# EasyEDA Pro project ProPrj_CyberRP_2025-01-25.epro

# Schematic Schematic1
Create Date: 2025-01-18; Page Name: P1; Project Name: CyberRP; Schematic Name: Schematic1; Update Date: 2025-01-19; Company: 嘉立创EDA; Page Size: A4; Version: V1.0
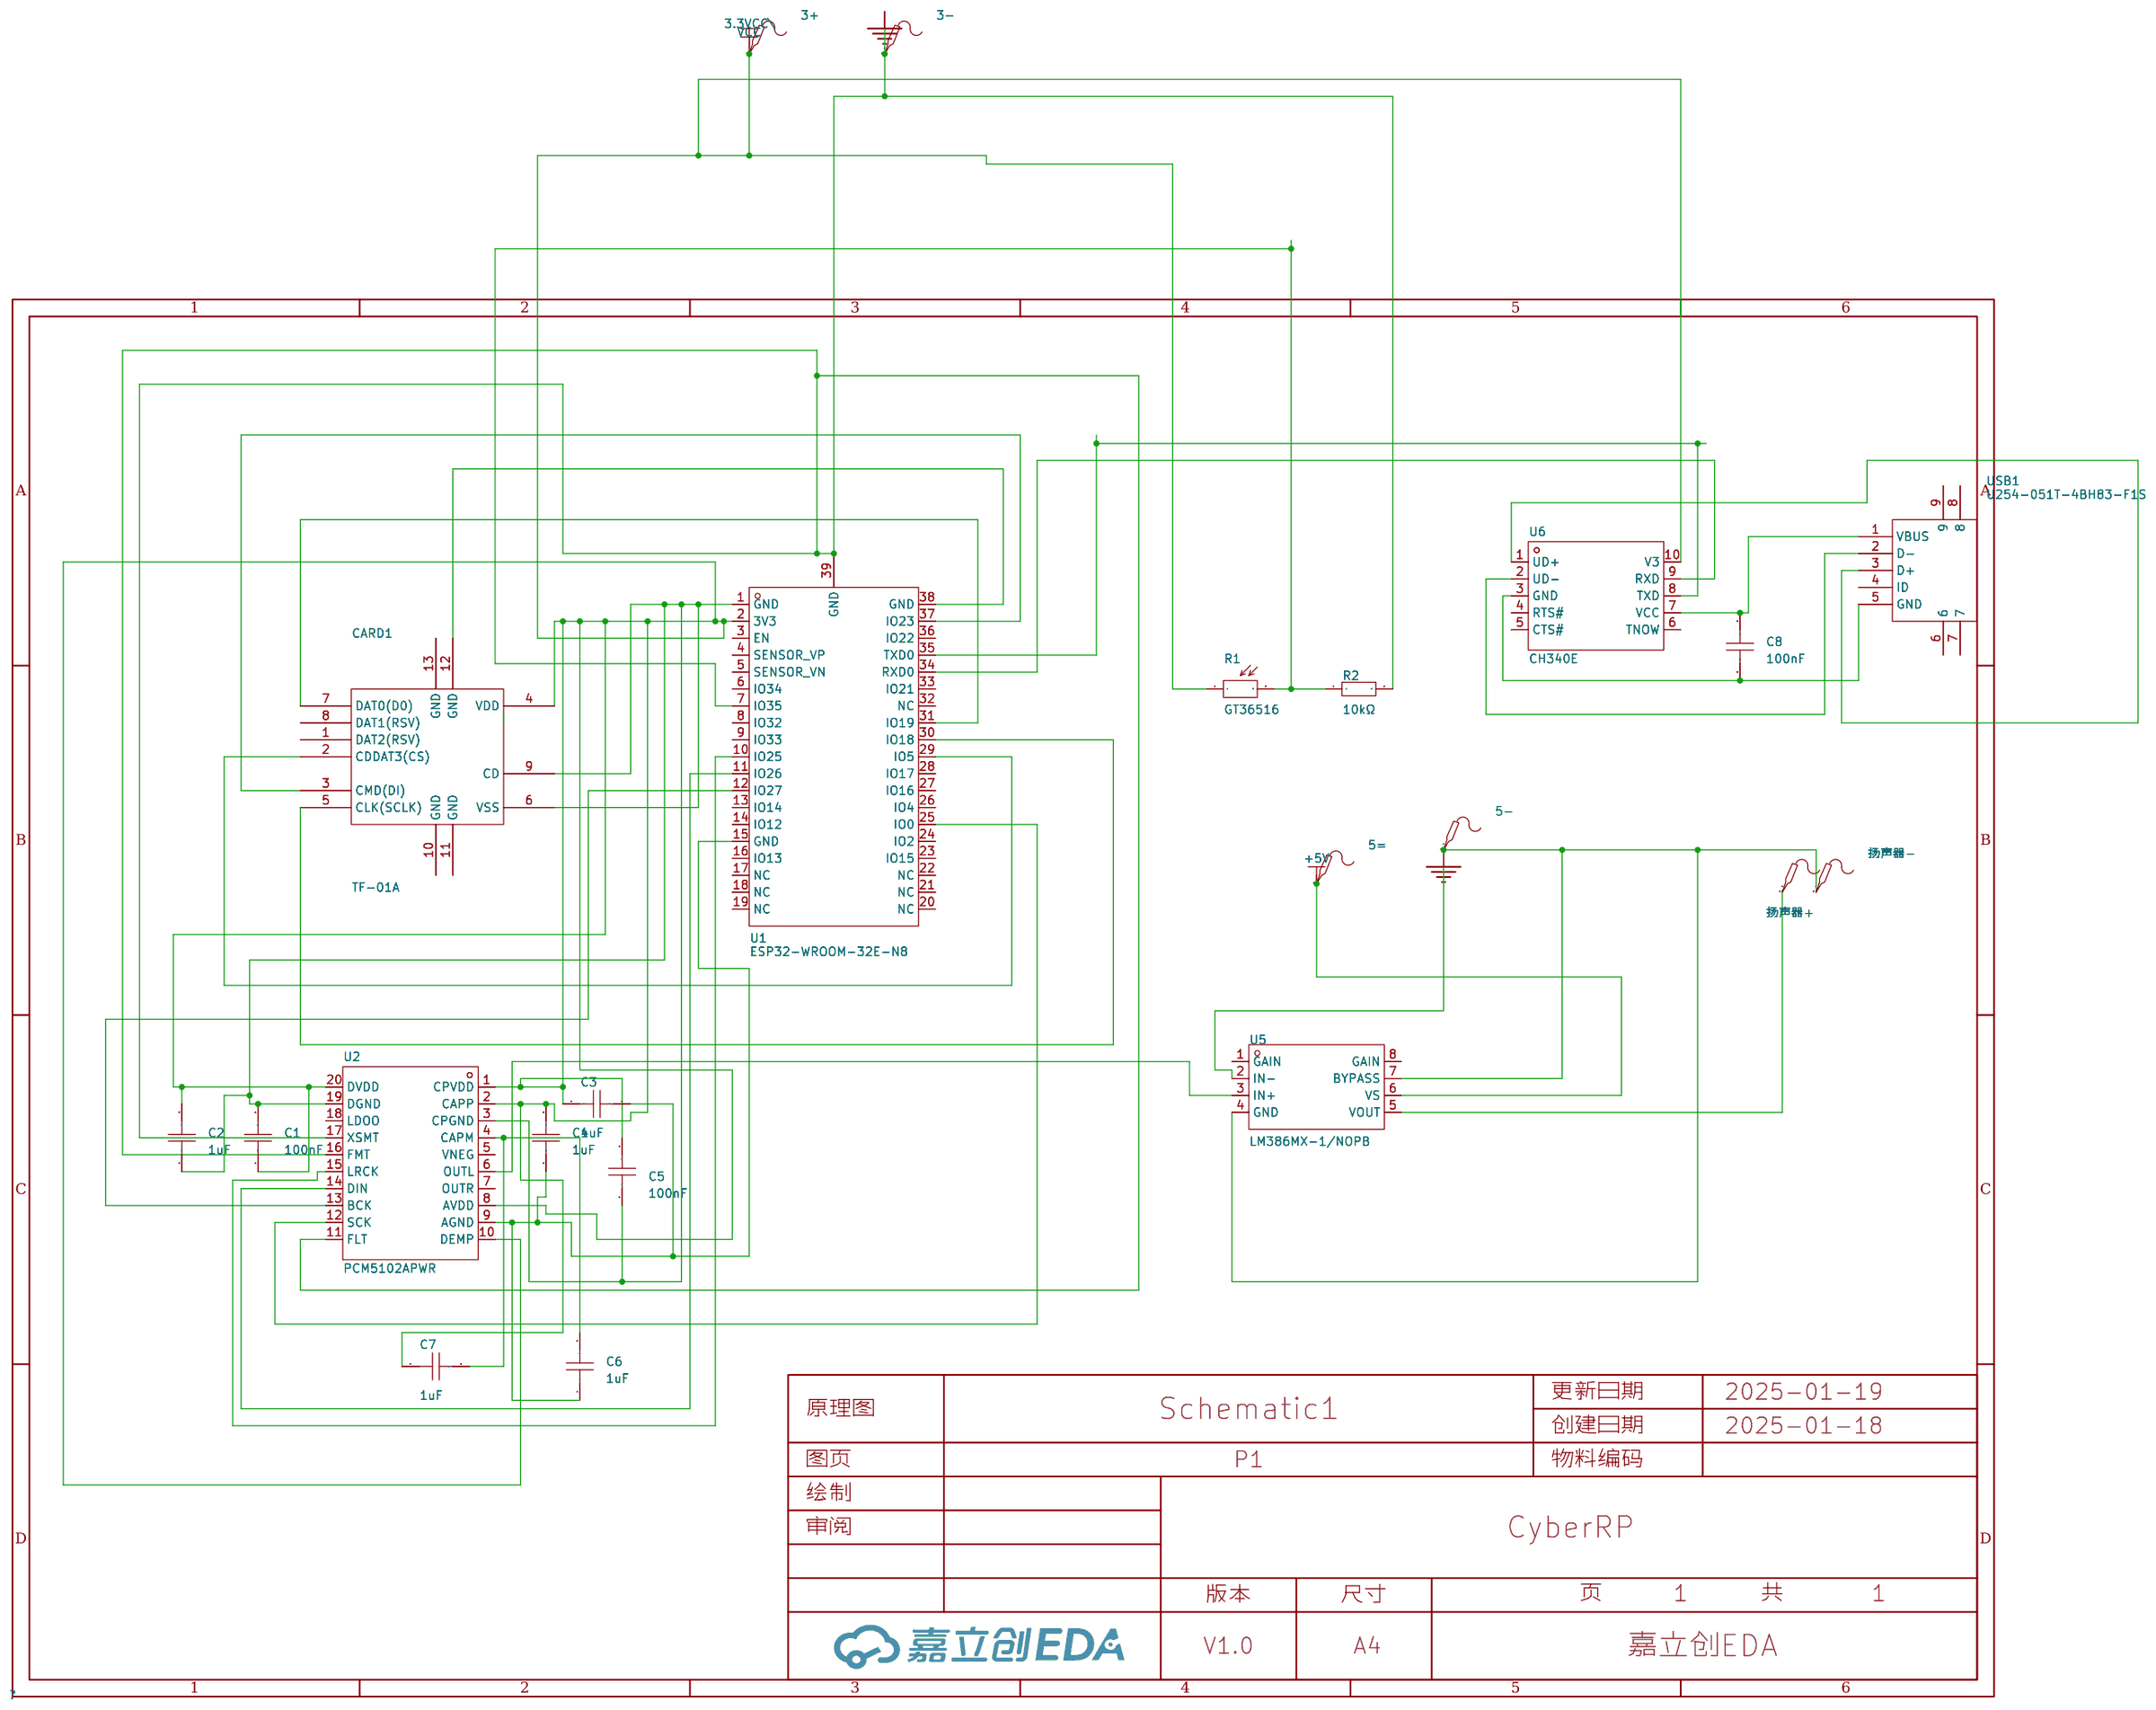
[diagram p0: schematic sheet]

## Parts
3+  -  [Test-Point-0.5mm]
3-  -  [Test-Point-0.5mm]
5-  -  [Test-Point-0.5mm]
5=  -  [Test-Point-0.5mm]
C1  100nF  [C0603]
C2  1uF  [C0603]
C3  1uF  [C0603]
C4  1uF  [C0603]
C5  100nF  [C0603]
C6  1uF  [C0603]
C7  1uF  [C0603]
C8  100nF  [C0603]
CARD1  TF-01A  [TF-SMD_TF-01A]
R1  GT36516  [RES-SMD_L3.6-W2.4]
R2  10kΩ  [R0603]
U1  ESP32-WROOM-32E-N8  [WIFI-SMD_ESP32-WROOM-32E]
U2  PCM5102APWR  [TSSOP-20_L6.5-W4.4-P0.65-LS6.4-BL]
U5  LM386MX-1/NOPB  [SOIC-8_L4.9-W3.9-P1.27-LS6.0-BL]
U6  CH340E  [MSOP-10_L3.0-W3.0-P0.50-LS5.0-BL]
USB1  U254-051T-4BH83-F1S  [MICRO-USB-SMD_U254-051T-4BH83-F1S]
扬声器+  -  [Test-Point-0.5mm]
扬声器-  -  [Test-Point-0.5mm]

## Library data of the parts
3+ 3- 5- 5= 扬声器+ 扬声器- = Test-Point: Test Point 测试点
C1 C8 = CGA0603X7R104K500JT: 容值:100nF;精度:±10%;额定电压:50V;材质(温度系数):X7R;; LCSC Part Name: 100nF ±10% 50V; Supplier Part: C6119867; Manufacturer: HRE(芯声); Supplier Footprint: 0603; JLCPCB Part Class: 扩展库; Supplier: LCSC; Tolerance: ±10%; Voltage Rated: 50V; Temperature Coefficient: X7R
C2-C4 C6 C7 = CL10A105KB8NNNC: 容值:1uF;精度:±10%;额定电压:50V;材质(温度系数):X5R;; LCSC Part Name: 1uF ±10% 50V; Supplier Part: C15849; Manufacturer: SAMSUNG(三星); Supplier Footprint: 0603; JLCPCB Part Class: 基础库; Datasheet: https://atta.szlcsc.com/upload/public/pdf/source/20160218/1457707763339.pdf; Supplier: LCSC; Tolerance: ±10%; Voltage Rated: 50V; Temperature Coefficient: X5R
C5 = CL10B104KB8NNNC: 容值:100nF;精度:±10%;额定电压:50V;材质(温度系数):X7R;; LCSC Part Name: 100nF ±10% 50V; Supplier Part: C1591; Manufacturer: SAMSUNG(三星); Supplier Footprint: 0603; JLCPCB Part Class: 扩展库; Datasheet: https://atta.szlcsc.com/upload/public/pdf/source/20160218/1457707763339.pdf; Supplier: LCSC; Tolerance: ±10%; Voltage Rated: 50V; Temperature Coefficient: X7R
CARD1 = TF-01A_C91145: 卡连接方式:自弹式;卡类型:MicroSD卡(TF卡);连接器类型:卡座;本体最大高度:1.85mm;工作温度范围:-;; LCSC Part Name: 自弹式 MicroSD卡(TF卡) 卡座; Supplier Part: C91145; Manufacturer: 韩国韩荣; Supplier Footprint: SMD; JLCPCB Part Class: 扩展库; Datasheet: https://atta.szlcsc.com/upload/public/pdf/source/20190322/C91145_63CBD6FB4639A3A3EC6A9721F18AE0FB.pdf; Supplier: LCSC; Card Connection Mode: 自弹式; Card Type: MicroSD卡(TF卡); Connector Type: 卡座; Supplementary Features: 带定位柱; Maximum Body Height: 1.85mm
R1 = GT36516: 光敏电阻; Supplier Part: C2904880; Manufacturer: JCHL(晶创和立); Supplier Footprint: SMD,2.4x3.6mm; JLCPCB Part Class: 扩展库; Datasheet: https://atta.szlcsc.com/upload/public/pdf/source/20211015/E4E926A8609BA345C43880BD5DEBDBFD.pdf; Supplier: LCSC
R2 = 0603WAF1002T5E: 电阻类型:厚膜电阻;阻值:10kΩ;精度:±1%;功率:100mW;最大工作电压:75V;温度系数:±100ppm/℃;; LCSC Part Name: 厚膜电阻 10kΩ ±1% 100mW; Supplier Part: C25804; Manufacturer: UNI-ROYAL(厚声); Supplier Footprint: 0603; JLCPCB Part Class: 基础库; Datasheet: https://atta.szlcsc.com/upload/public/pdf/source/20200306/C422600_1E6D84923E4A46A82E41ADD87F860B5C.pdf; Supplier: LCSC; Type: 厚膜电阻; Tolerance: ±1%; Power(Watts): 100mW; Overload Voltage (Max): 75V; Temperature Coefficient: ±100ppm/℃; Operating Temperature Range: -55℃~+155℃
U1 = ESP32-WROOM-32E-N8: ESP32-WROOM-32E 集成 ESP32-D0WD-V3 芯片，具有?高的稳定性和安全性能。; LCSC Part Name: 通用型Wi-Fi+BT+BLE MCU模组; Supplier Part: C701342; Manufacturer: ESPRESSIF(乐鑫); Supplier Footprint: SMD,18x25.5mm; JLCPCB Part Class: 扩展库; Datasheet: https://atta.szlcsc.com/upload/public/pdf/source/20240307/DEBA00FAE5BA634F0D73085E4F214E93.pdf; Supplier: LCSC
U2 = PCM5102APWR: 接口类型:PCM;供电电压:1.65V~3.46V;分辨率(位):24；16；32;; Supplier Part: C107671; Manufacturer: TI(德州仪器); Supplier Footprint: TSSOP-20; JLCPCB Part Class: 扩展库; Datasheet: https://www.ti.com/cn/lit/gpn/pcm5102a; Supplier: LCSC; Interface Type: PCM; Supply Voltage: 1.65V~3.46V; Number of Channels: 2; Resolution: 24；16；32; Operating Temperature: -25℃~+85℃
U5 = LM386MX-1/NOPB: 功放类型:AB类功放;扬声器通道数:单声道;输出功率:325mWx1@8Ω;; LCSC Part Name: 325mW单声道AB类音频功率放大器; Supplier Part: C23573; Manufacturer: TI(德州仪器); Supplier Footprint: SOIC-8-150mil; JLCPCB Part Class: 扩展库; Datasheet: https://www.ti.com/cn/lit/gpn/lm386; Supplier: LCSC; Type of Power Amplifier: AB类功放; Speaker Channels: 单声道; Output Power: 325mWx1@8Ω; Supply Voltage: 4V~12V; Operating Temperature: 0℃~+70℃
U6 = CH340E: 应用功能:收发器;接口协议:USB 2.0;数据速率:2Mbps;; LCSC Part Name: USB转串口芯片CH340; Supplier Part: C99652; Manufacturer: WCH(南京沁恒); Supplier Footprint: MSOP-10; JLCPCB Part Class: 扩展库; Datasheet: https://atta.szlcsc.com/upload/public/pdf/source/20240313/4FD4567B6A986AE079C4960D6CEBDDB5.pdf; Supplier: LCSC; Applications Function: 收发器; Protocol: USB 2.0; Supply Voltage: 3.3V；5V; Data Rate: 2Mbps
USB1 = U254-051T-4BH83-F1S: 连接器类型:Micro-B;标准:-;公母:母;安装方式:-;触点数量:5P;端口数量:1;额定电流 - 电源:1.8A;触头材质:铜合金;触头镀层:金;工作温度范围:-40℃~+85℃;焊接温度(最大值):260℃;; LCSC Part Name: Micro-B 母; Supplier Part: C397452; Manufacturer: XKB Connection(中国星坤); Supplier Footprint: SMD; JLCPCB Part Class: 扩展库; Datasheet: https://atta.szlcsc.com/upload/public/pdf/source/20220609/77F4601918B360C560709E834E5BE548.pdf; Supplier: LCSC; Connector Type: Micro-B; Gender: 母; Number of Contacts: 5P; Number of Ports: 1; Current Rating - Power (Max): 1.8A; Contact Material: 铜合金; Contact Plating: 金; Operating Temperature Range: -40℃~+85℃; Soldering Temperature(Max): 260℃

## Nets
+5V: 5=.1 U5.6(VS)
GND: 5-.1 U5.2(IN-) U5.4(GND) U5.7(BYPASS) 扬声器-.1
VCC: 3+.1 C1.1 C2.2 C3.1 C4.2 C5.1 C7.1 CARD1.4(VDD) R1.1 U1.2(3V3) U2.1(CPVDD) U2.2(CAPP) U2.8(AVDD) U2.10(DEMP) U2.20(DVDD) U6.10(V3)
3.3GND: 3-.1 R2.2 U1.39(GND) U2.11(FLT) U2.16(FMT) U2.17(XSMT)
$1N2705: CARD1.7(DAT0(D0)) U1.31(IO19)
$1N2711: CARD1.2(CDDAT3(CS)) U1.29(IO5)
$1N2735: CARD1.3(CMD(DI)) U1.37(IO23)
$1N2743: CARD1.5(CLK(SCLK)) U1.30(IO18)
$1N3554: U1.10(IO25) U2.15(LRCK)
$1N3572: U1.11(IO26) U2.14(DIN)
$1N3599: U1.12(IO27) U2.13(BCK)
$1N3623: U1.25(IO0) U2.12(SCK)
$1N4800: CARD1.12(GND) U1.38(GND)
$1N5629: C1.2 C2.1 C5.2 CARD1.6(VSS) CARD1.9(CD) U1.1(GND) U2.3(CPGND) U2.19(DGND)
$1N5977: C3.2 C4.1 C6.1 U1.15(GND) U2.9(AGND)
$1N6377: C6.2 C7.2 U2.4(CAPM)
$1N7060: U2.6(OUTL) U5.3(IN+)
$1N7277: U5.5(VOUT) 扬声器+.1
$1N7801: R1.2 R2.1 U1.7(IO35)
$1N8491: U6.2(UD-) USB1.2(D-)
$1N8514: U6.1(UD+) USB1.3(D+)
$1N8590: C8.1 U6.3(GND) USB1.5(GND)
$1N8673: C8.2 U6.7(VCC) USB1.1(VBUS)
$1N8909: U1.34(RXD0) U6.9(RXD)
$1N8955: U1.35(TXD0) U6.8(TXD)

Not connected (* = marked no-connect by the designer): CARD1 1(DAT2(RSV)) 8(DAT1(RSV)) 10(GND) 11(GND) 13(GND); U1 3(EN) 4(SENSOR_VP) 5(SENSOR_VN) 6(IO34) 8(IO32) 9(IO33) 13(IO14) 14(IO12) 16(IO13) 17(NC) 18(NC) 19(NC) 20(NC) 21(NC) 22(NC) 23(IO15) 24(IO2) 26(IO4) 27(IO16) 28(IO17) 32(NC) 33(IO21) 36(IO22); U2 5(VNEG) 7(OUTR) 18(LDOO); U5 1(GAIN) 8(GAIN); U6 4(RTS#) 5(CTS#) 6(TNOW); USB1 4(ID) 6 7 8 9

# Board PCB3
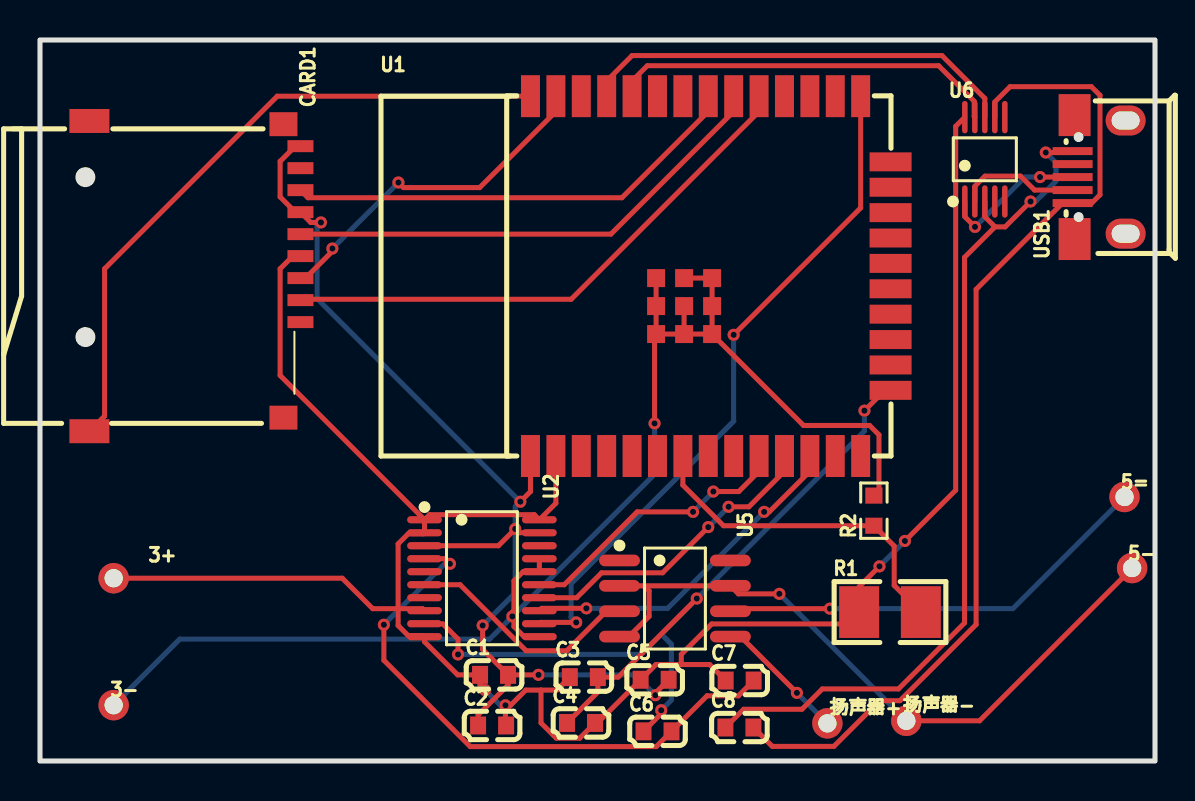
[diagram p1: board, top side]
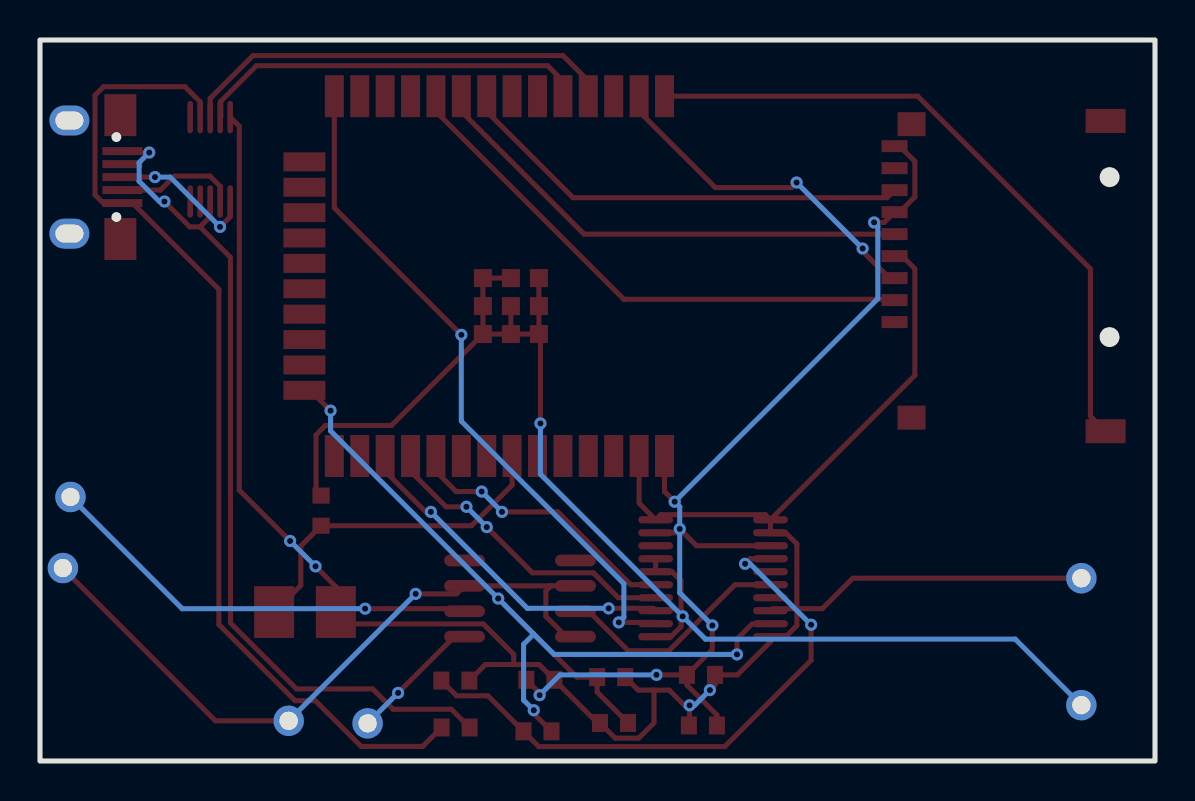
[diagram p2: board, bottom side, seen from below]

Outline 55.75 x 36.07 mm; copper layers: Top Layer, Bottom Layer. Coordinates in mm from the lower left corner of the outline.
Outline path: rectangle 0,36.07 55.75,0
Stack: Top Layer 0.035mm / Dielectric1 1.51mm FR4 er 4.5 / Bottom Layer 0.035mm

## Design rules (mm)
template: JLCPCB Capability(Two Layers Board)
spacing copperThickness1oz (default): track to track 0.102, other pairs 0.152 to 0.3
spacing copperThickness2oz: track to track 0.203, other pairs 0.152 to 0.3
track width copperThickness1oz (default): min 0.127, default 0.254, max 2.54
track width copperThickness2oz: min 0.203, default 0.254, max 2.54
differential pair differentialPair (default): width min 0.127, default 0.254, max 2.54; gap min 0.152, default 0.152
via viaSize (default): diameter min 0.5, default 0.61, max 10; hole min 0.3, default 0.305, max 6.3

## Placement (name value [footprint] x y rotation side)
3+  -  [Test-Point-0.5mm]  3.68 9.11 0 top
3-  -  [Test-Point-0.5mm]  3.68 2.79 0 top
5-  -  [Test-Point-0.5mm]  54.57 9.6 0 top
5=  -  [Test-Point-0.5mm]  54.21 13.17 0 top
C1  100nF  [C0603]  22.7 4.31 0 top
C2  1uF  [C0603]  22.61 1.78 0 top
C3  1uF  [C0603]  27.19 4.2 0 top
C4  1uF  [C0603]  27.05 1.91 0 top
C5  100nF  [C0603]  30.73 4.06 0 top
C6  1uF  [C0603]  30.88 1.49 0 top
C7  1uF  [C0603]  34.99 4.03 0 top
C8  100nF  [C0603]  34.97 1.68 0 top
CARD1  TF-01A  [TF-SMD_TF-01A]  7.75 24.26 270 top
NOREF  -  [Pad_e37]  54.23 13.21 0 top
NOREF#2  -  [Pad_e36]  54.61 9.65 0 top
NOREF#3  -  [Pad_e35]  39.37 1.88 0 top
NOREF#4  -  [Pad_e32]  3.68 2.79 0 top
NOREF#5  -  [Pad_e33]  3.68 9.14 0 top
NOREF#6  -  [Pad_e34]  43.32 2.01 0 top
R1  GT36516  [RES-SMD_L3.6-W2.4]  42.5 7.45 0 top
R2  10kΩ  [R0603]  41.7 12.52 90 top
U1  ESP32-WROOM-32E-N8  [WIFI-SMD_ESP32-WROOM-32E]  33.53 24.26 0 top
U2  PCM5102APWR  [TSSOP-20_L6.5-W4.4-P0.65-LS6.4-BL]  22.1 9.14 270 top
U5  LM386MX-1/NOPB  [SOIC-8_L4.9-W3.9-P1.27-LS6.0-BL]  31.75 8.13 270 top
U6  CH340E  [MSOP-10_L3.0-W3.0-P0.50-LS5.0-BL]  47.24 30.1 0 top
USB1  U254-051T-4BH83-F1S  [MICRO-USB-SMD_U254-051T-4BH83-F1S]  52.96 29.21 90 top
扬声器+  -  [Test-Point-0.5mm]  39.65 1.88 0 top
扬声器-  -  [Test-Point-0.5mm]  43.32 2.01 0 top

## Footprints (pads in the part's own frame, mm; a bottom-side part is the same pattern mirrored in y, then rotated)
C0603
  rect 0.8x0.9 smd: 1(-0.7,0) 2(0.7,0)
MICRO-USB-SMD_U254-051T-4BH83-F1S
  rect 0.4x2 smd: 1(-1.3,1.325) 2(-0.65,1.325) 3(0,1.325) 4(0.65,1.325) 5(1.3,1.325)
  rect 2.1x1.6 smd: 6(3.1,1.225) 7(-3.1,1.225)
  oval 1.5x2 hole 0.9x1.4: 8(-2.83,-1.325) 9(2.83,-1.325)
MSOP-10_L3.0-W3.0-P0.50-LS5.0-BL
  oval 0.28x1.62 smd: 1(-1,-2.11) 2(-0.5,-2.11) 3(0,-2.11) 4(0.5,-2.11) 5(1,-2.11) 6(1,2.11) 7(0.5,2.11) 8(0,2.11) 9(-0.5,2.11) 10(-1,2.11)
Pad_e32
  round 1.524 hole 0.914: 40(0,0)
Pad_e33
  round 1.524 hole 0.914: 41(0,0)
Pad_e34
  round 1.524 hole 0.914: 42(0,0)
Pad_e35
  round 1.524 hole 0.914: 43(0,0)
Pad_e36
  round 1.524 hole 0.914: 44(0,0)
Pad_e37
  round 1.524 hole 0.914: 45(0,0)
R0603
  rect 0.806x0.864 smd: 1(-0.753,0) 2(0.753,0)
RES-SMD_L3.6-W2.4
  rect 2x2.592 smd: 1(-1.542,0) 2(1.542,0)
SOIC-8_L4.9-W3.9-P1.27-LS6.0-BL
  oval 0.588x2.045 smd: 1(-1.905,-2.772) 2(-0.635,-2.772) 3(0.635,-2.772) 4(1.905,-2.772) 5(1.905,2.772) 6(0.635,2.772) 7(-0.635,2.772) 8(-1.905,2.772)
Test-Point-0.5mm
  round 0.5 smd: 1(0,0)
TF-SMD_TF-01A
  rect 0.6x1.3 smd: 1(2.3,5.276) 2(1.2,5.276) 3(0.101,5.276) 4(-1,5.276) 5(-2.099,5.276) 6(-3.2,5.276) 7(-4.3,5.276) 8(-5.399,5.276) 9(-6.5,5.276)
  rect 1.2x1.4 smd: 10(-7.599,4.426) 13(7.08,4.426)
  rect 1.2x2 smd: 11(-7.76,-5.276) 12(7.76,-5.276)
TSSOP-20_L6.5-W4.4-P0.65-LS6.4-BL
  oval 0.364x1.742 smd: 1(-2.925,-2.871) 2(-2.275,-2.871) 3(-1.625,-2.871) 4(-0.975,-2.871) 5(-0.325,-2.871) 6(0.325,-2.871) 7(0.975,-2.871) 8(1.625,-2.871) 9(2.275,-2.871) 10(2.925,-2.871) 11(2.925,2.871) 12(2.275,2.871) 13(1.625,2.871) 14(0.975,2.871) 15(0.325,2.871) 16(-0.325,2.871) 17(-0.975,2.871) 18(-1.625,2.871) 19(-2.275,2.871) 20(-2.925,2.871)
WIFI-SMD_ESP32-WROOM-32E
  rect 0.95x2.1 smd: 1(-9.002,-9) 2(-7.732,-9) 3(-6.463,-9) 4(-5.192,-9) 5(-3.922,-9) 6(-2.652,-9) 7(-1.383,-9) 8(-0.113,-9) 9(1.157,-9) 10(2.428,-9) 11(3.697,-9) 12(4.968,-9) 13(6.237,-9) 14(7.508,-9) 25(7.508,9) 26(6.237,9) 27(4.968,9) 28(3.697,9) 29(2.428,9) 30(1.157,9) 31(-0.113,9) 32(-1.383,9) 33(-2.652,9) 34(-3.922,9) 35(-5.192,9) 36(-6.463,9) 37(-7.732,9) 38(-9.002,9)
  rect 2.1x0.95 smd: 15(9.002,-5.715) 16(9.002,-4.445) 17(9.002,-3.175) 18(9.002,-1.905) 19(9.002,-0.635) 20(9.002,0.635) 21(9.002,1.905) 22(9.002,3.175) 23(9.002,4.445) 24(9.002,5.715)
  rect 0.9x0.9 smd: 39(-2.721,-0.1) 39(-2.721,-1.5) 39(-2.721,-2.9) 39(-1.321,-0.1) 39(-1.321,-1.5) 39(-1.321,-2.9) 39(0.079,-0.1) 39(0.079,-1.5) 39(0.079,-2.9)

## Nets
As in the schematic, except:
+5V: 5=.1 NOREF.45 U5.6
GND: 5-.1 NOREF#2.44 NOREF#6.42 U5.2 U5.4 U5.7 扬声器-.1
3.3GND: 3-.1 NOREF#4.40 R2.2 U1.39 U2.11 U2.16 U2.17
$1N7277: NOREF#3.43 U5.5 扬声器+.1
$1N7422: 3+.1 C1.1 C2.2 C3.1 C4.2 C5.1 C7.1 CARD1.4 NOREF#5.41 R1.1 U1.2 U2.1 U2.2 U2.8 U2.10 U2.20 U6.10

Pads without a net: CARD1 1 8 10 11 13; U1 3 4 5 6 8 9 13 14 16 17 18 19 20 21 22 23 24 26 27 28 32 33 36; U2 5 7 18; U5 1 8; U6 4 5 6; USB1 4 6 7 8 9

## Via types
v1: diameter 0.61, hole 0.305, Top Layer to Bottom Layer, 35 vias

## Routing (per net, layer and track width the routed paths; a pad name or vN(x,y) marks a point on that pad's centre or on a via; arc(x,y) is an arc through that point)
+5V: length 22.1
  Top Layer w0.254: U5.6 34.65,7.62 v1(39.5,7.62)
  Bottom Layer w0.254: v1(39.5,7.62) 48.64,7.62 NOREF.45
GND: length 35.1
  Top Layer w0.254: NOREF#2.44 54.57,9.61 5-.1 46.98,2.01 NOREF#6.42 ; U5.4 29.44,6.22 30.46,7.24 30.46,8.51 30.2,8.76 ; 30.2,8.76 U5.2 ; 30.2,8.76 U5.7 34.92,8.36 v1(36.97,8.36)
  Bottom Layer w0.254: NOREF#6.42 v1(36.97,8.36)
3.3GND: length 69.8
  Top Layer w0.254: 23.7,7.49 23.66,7.49 23.62,7.45 v1(23.62,7.23) ; 23.7,7.49 23.7,9.01 24.16,9.47 U2.16 U2.17 ; 23.7,7.49 23.7,6.73 24.21,6.22 U2.11 ; U1.39 U1.39 U1.39 U1.39 ; U1.39 U1.39 ; U1.39 38.18,16.78 41.48,16.78 41.95,16.31 41.95,13.53 41.7,13.28 ; U1.39 U1.39 ; U1.39 U1.39 ; U1.39 U1.39 U1.39 ; v1(30.73,16.89) 30.73,21.28 U1.39
  Bottom Layer w0.254: v1(30.73,16.89) 30.73,14.35 v1(23.62,7.23) 22.48,6.1 6.99,6.1 NOREF#4.40
$1N2705: length 23.1
  Top Layer w0.254: U1.31 33.42,32.49 29.1,28.18 13.4,28.18 CARD1.7
$1N2711: length 27.6
  Top Layer w0.254: CARD1.2 13.06,23.1 26.56,23.1 35.96,32.49 U1.29
$1N2735: length 17.3
  Top Layer w0.254: CARD1.3 13.28,24.16 14.62,25.5 v1(14.62,25.64) ; U1.37 25.8,32.49 21.99,28.69 18.18,28.69 v1(17.92,28.94)
  Bottom Layer w0.254: v1(17.92,28.94) v1(14.62,25.64)
$1N2743: length 25
  Top Layer w0.254: U1.30 34.69,32.49 28.55,26.36 CARD1.5
$1N3554: length 14.1
  Top Layer w0.254: v1(32.65,12.46) 29.86,12.46 26.22,8.82 U2.15 ; U1.10 35.96,14.49 34.94,13.48 v1(33.67,13.48)
  Bottom Layer w0.254: v1(33.67,13.48) v1(32.65,12.46)
$1N3572: length 15.6
  Top Layer w0.254: v1(33.42,11.7) 31.13,9.41 28.08,9.41 26.84,8.17 U2.14 ; v1(34.43,12.72) 35.45,12.72 37.23,14.49 U1.11
  Bottom Layer w0.254: v1(34.43,12.72) v1(33.42,11.7)
$1N3599: length 17.2
  Top Layer w0.254: U1.12 38.5,14.49 36.46,12.46 v1(36.21,12.46) ; v1(27.32,7.64) 25.09,7.64 U2.13
  Bottom Layer w0.254: v1(27.32,7.64) 31.38,7.64 v1(36.21,12.46)
$1N3623: length 34.3
  Top Layer w0.254: U2.12 25.03,6.93 v1(26.81,6.93) ; v1(34.69,21.32) 41.04,27.67 U1.25
  Bottom Layer w0.254: v1(34.69,21.32) 34.69,17 26.56,8.87 26.56,7.19 v1(26.81,6.93)
$1N4800: length 33.3
  Top Layer w0.254: U1.38 11.87,33.26 3.23,24.62 3.23,17.25 CARD1.12
$1N5629: length 54.6
  Top Layer w0.254: v1(14.05,26.94) 13.54,26.94 CARD1.6 12.77,27.46 12.01,28.22 12.01,30 12.77,30.76 CARD1.9 ; v1(24.02,12.97) 24.53,13.48 U1.1 ; C1.2 22.13,5.58 v1(22.13,6.78) ; C1.2 23.4,3.8 21.91,2.3 C2.1 ; C1.2 v1(24.93,4.31) ; U2.3 22.92,10.77 v1(23.76,11.61) 23.95,11.42 U2.19 ; C5.2 30.77,3.4 v1(30.77,3.29)
  Bottom Layer w0.254: v1(24.93,4.31) 29.75,4.31 v1(30.77,3.29) ; v1(22.13,6.78) 23.76,8.41 v1(23.76,11.61) 23.76,12.72 v1(24.02,12.97) 13.86,23.13 13.86,26.75 v1(14.05,26.94)
$1N5977: length 45.6
  Top Layer w0.254: v1(20.9,5.33) 20.9,6.1 20.14,6.86 19.24,6.86 U2.9 ; v1(32.84,8.13) 28.91,4.2 C3.2 27.89,3.45 C4.1 ; 42.53,18.54 42.24,18.54 v1(41.22,17.53) ; C6.1 31.06,2.37 v1(31.06,2.54)
  Bottom Layer w0.254: 31.06,6.35 31.57,5.84 31.57,3.05 v1(31.06,2.54) ; 31.06,6.35 30.05,5.33 v1(20.9,5.33) ; 31.06,6.35 v1(32.84,8.13) 41.22,16.51 v1(41.22,17.53)
$1N6377: length 29.4
  Top Layer w0.254: U2.4 20.24,10.12 v1(20.5,9.86) ; C7.2 34.92,3.26 33.36,3.26 C6.2 30.81,0.72 21.51,0.72 17.19,5.04 v1(17.19,6.82)
  Bottom Layer w0.254: v1(20.5,9.86) 20.24,9.86 v1(17.19,6.82)
$1N7060: length 11.9
  Top Layer w0.254: U5.3 28.31,7.49 26.34,5.52 24.31,5.52 21,8.82 U2.6
$1N7277: length 6.9
  Top Layer w0.254: NOREF#3.43 扬声器+.1 ; U5.5 35.03,6.22 v1(37.85,3.41)
  Bottom Layer w0.254: NOREF#3.43 v1(37.85,3.41)
$1N7422: length 111.4
  Top Layer w0.252: R1.1 40.96,8.72 v1(41.98,9.74) ; v1(43.25,11.01) 45.79,13.55 45.79,31.75 U6.10
  Top Layer w0.254: 25.05,3.55 25.05,1.91 25.81,1.14 26.99,1.14 C4.2 27.88,1.91 30.8,4.83 32.07,4.83 ; 25.05,3.55 24.29,3.55 23.53,2.79 v1(23.27,2.79) 23.27,1.81 C2.2 ; 25.05,3.55 25.84,3.55 C3.1 ; C7.1 33.49,4.83 32.07,4.83 ; U2.1 12.01,19.29 12.01,24.62 12.64,25.26 CARD1.4 ; U2.1 19.48,12.32 24.72,12.32 U2.20 25.8,12.9 U1.2 ; U2.1 U2.2 19.18,11.37 18.41,11.37 17.91,10.86 17.91,7.62 ; 17.91,7.62 19.13,7.62 U2.8 ; 17.91,7.62 16.64,7.62 15.11,9.14 NOREF#5.41 ; 17.91,7.62 17.91,6.78 18.41,6.27 19.18,6.27 U2.10 19.23,5.96 20.88,4.31 C1.1 22,3.8 v1(22.26,3.55) ; 32.07,4.83 32.07,5.33 33.59,6.86 40.37,6.86 R1.1
  Bottom Layer w0.252: v1(41.98,9.74) v1(43.25,11.01)
  Bottom Layer w0.254: v1(23.27,2.79) 23.02,2.79 v1(22.26,3.55)
$1N7801: length 17.1
  Top Layer w0.254: U1.7 32.15,13.8 34.18,11.77 R2.1 42.71,10.75 42.71,8.78 R1.2
$1N8491: length 6.2
  Top Layer w0.252: U6.2 46.74,28.75 47.25,29.26 49.03,29.26 49.73,28.56 USB1.2
$1N8514: length 7.4
  Top Layer w0.252: v1(46.75,26.72) 46.24,27.23 U6.1 ; v1(50,29.21) USB1.3
  Bottom Layer w0.252: v1(50,29.21) 49.24,29.21 v1(46.75,26.72)
$1N8590: length 43.1
  Top Layer w0.252: U6.3 47.24,27.23 47.75,26.72 ; 47.75,26.72 46.23,25.19 46.23,6.91 42.93,3.6 39.12,3.6 38.1,2.59 35.18,2.59 C8.1 ; 47.75,26.72 48.26,26.72 v1(49.53,27.99) ; v1(50.29,30.44) 51.56,30.44 USB1.5
  Bottom Layer w0.252: v1(50.29,30.44) 50.8,29.93 50.8,29 49.78,27.99 v1(49.53,27.99)
$1N8673: length 50.5
  Top Layer w0.252: U6.7 47.74,32.97 48.51,33.73 52.57,33.73 53,33.3 53,28.32 52.57,27.89 51.65,27.89 USB1.1
  Top Layer w0.254: USB1.1 51.13,27.91 46.81,23.59 46.81,6.83 43,3.02 41.98,3.02 39.7,0.73 36.62,0.73 C8.2
$1N8909: length 19.7
  Top Layer w0.252: U1.34 29.61,34.02 30.37,34.78 44.93,34.78 46.71,33 46.71,32.24 U6.9
$1N8955: length 22
  Top Layer w0.252: U1.35 28.34,34.02 29.61,35.29 45.1,35.29 47.24,33.14 U6.8

# Board PCB2
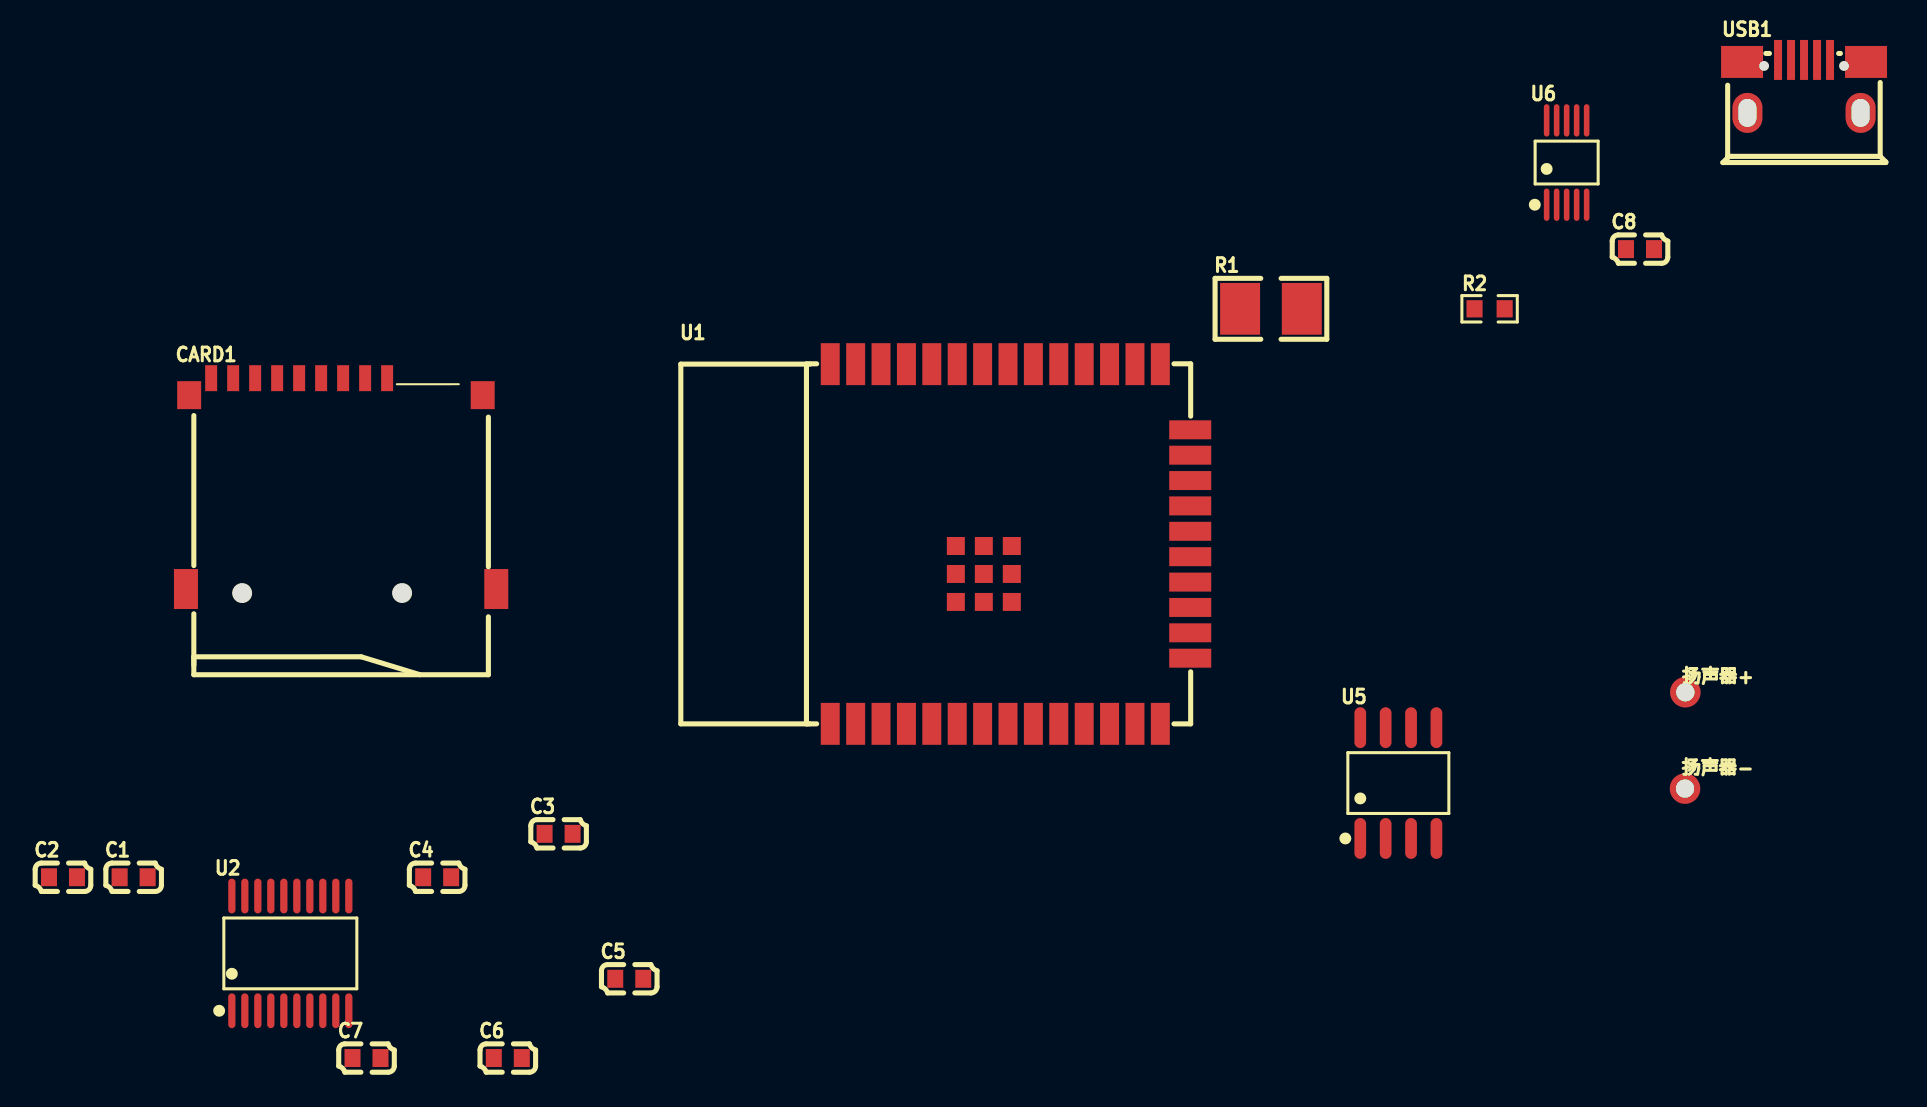
[diagram p3: board, top side]
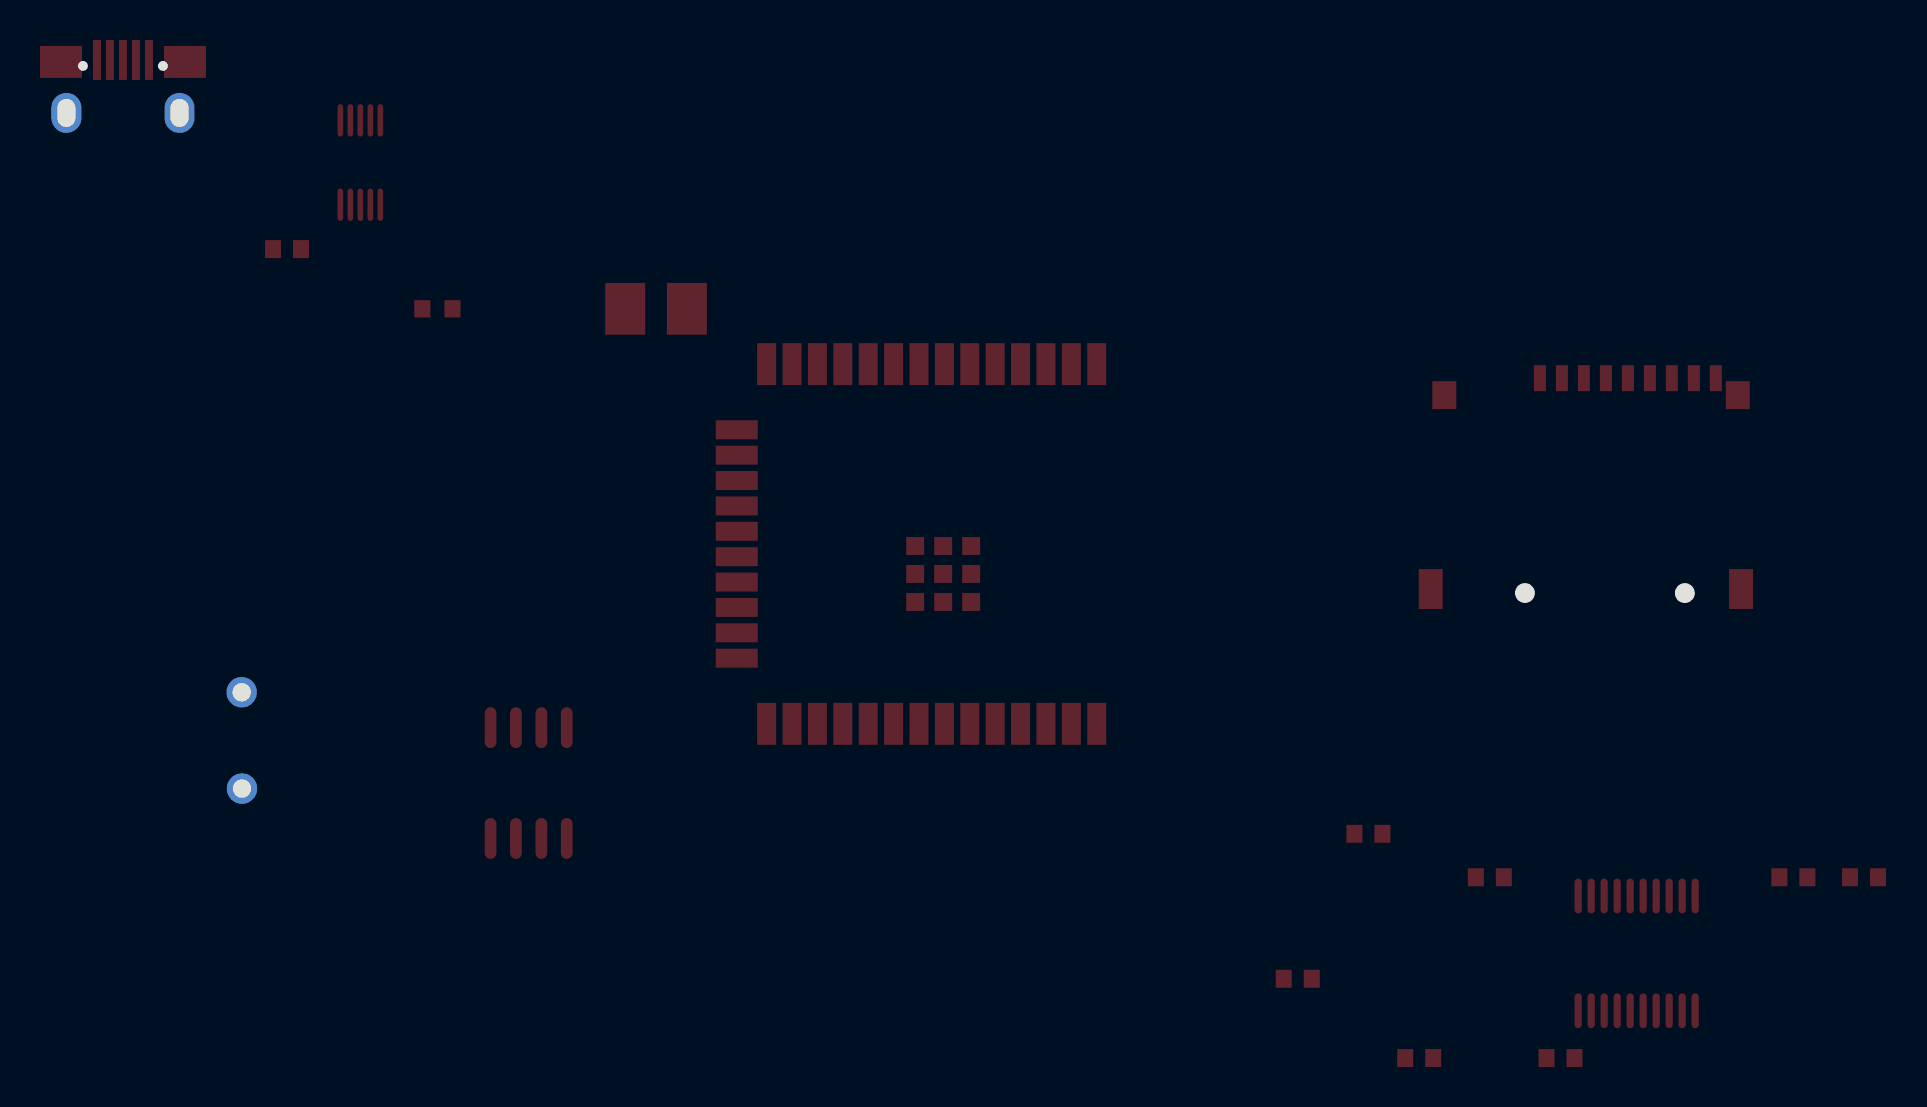
[diagram p4: board, bottom side, seen from below]

Outline 80.86 x 27.12 mm; copper layers: Top Layer, Bottom Layer. Coordinates in mm from the lower left corner of the outline.
Stack: Top Layer 0.035mm / Dielectric1 1.51mm FR4 er 4.5 / Bottom Layer 0.035mm

## Design rules (mm)
template: JLCPCB Capability(Two Layers Board)
spacing copperThickness1oz (default): track to track 0.102, other pairs 0.152 to 0.3
spacing copperThickness2oz: track to track 0.203, other pairs 0.152 to 0.3
track width copperThickness1oz (default): min 0.127, default 0.254, max 2.54
track width copperThickness2oz: min 0.203, default 0.254, max 2.54
differential pair differentialPair (default): width min 0.127, default 0.254, max 2.54; gap min 0.152, default 0.152
via viaSize (default): diameter min 0.5, default 0.61, max 10; hole min 0.3, default 0.305, max 6.3

## Placement (name value [footprint] x y rotation side)
C1  100nF  [C0603]  -4.93 -13.73 0 top
C2  1uF  [C0603]  -8.47 -13.73 0 top
C3  1uF  [C0603]  16.32 -11.55 0 top
C4  1uF  [C0603]  10.25 -13.73 0 top
C5  100nF  [C0603]  19.86 -18.81 0 top
C6  1uF  [C0603]  13.78 -22.77 0 top
C7  1uF  [C0603]  6.72 -22.77 0 top
C8  100nF  [C0603]  70.41 17.71 0 top
CARD1  TF-01A  [TF-SMD_TF-01A]  5.45 5.97 0 top
NOREF  -  [Pad_e18]  72.68 -4.47 0 top
NOREF#2  -  [Pad_e19]  72.66 -9.29 0 top
R1  GT36516  [RES-SMD_L3.6-W2.4]  51.95 14.72 0 top
R2  10kΩ  [R0603]  62.89 14.72 0 top
U1  ESP32-WROOM-32E-N8  [WIFI-SMD_ESP32-WROOM-32E]  38.91 2.95 0 top
U2  PCM5102APWR  [TSSOP-20_L6.5-W4.4-P0.65-LS6.4-BL]  2.91 -17.54 0 top
U5  LM386MX-1/NOPB  [SOIC-8_L4.9-W3.9-P1.27-LS6.0-BL]  58.32 -9.01 0 top
U6  CH340E  [MSOP-10_L3.0-W3.0-P0.50-LS5.0-BL]  66.74 22.04 0 top
USB1  U254-051T-4BH83-F1S  [MICRO-USB-SMD_U254-051T-4BH83-F1S]  78.61 25.85 0 top
扬声器+  -  [Test-Point-0.5mm]  72.68 -4.47 0 top
扬声器-  -  [Test-Point-0.5mm]  72.66 -9.04 0 top

## Footprints (pads in the part's own frame, mm; a bottom-side part is the same pattern mirrored in y, then rotated)
C0603
  rect 0.8x0.9 smd: 1(-0.7,0) 2(0.7,0)
MICRO-USB-SMD_U254-051T-4BH83-F1S
  rect 0.4x2 smd: 1(-1.3,1.325) 2(-0.65,1.325) 3(0,1.325) 4(0.65,1.325) 5(1.3,1.325)
  rect 2.1x1.6 smd: 6(3.1,1.225) 7(-3.1,1.225)
  oval 1.5x2 hole 0.9x1.4: 8(-2.83,-1.325) 9(2.83,-1.325)
MSOP-10_L3.0-W3.0-P0.50-LS5.0-BL
  oval 0.28x1.62 smd: 1(-1,-2.11) 2(-0.5,-2.11) 3(0,-2.11) 4(0.5,-2.11) 5(1,-2.11) 6(1,2.11) 7(0.5,2.11) 8(0,2.11) 9(-0.5,2.11) 10(-1,2.11)
Pad_e18
  round 1.524 hole 0.914: 40(0,0)
Pad_e19
  round 1.524 hole 0.914: 41(0,0)
R0603
  rect 0.806x0.864 smd: 1(-0.753,0) 2(0.753,0)
RES-SMD_L3.6-W2.4
  rect 2x2.592 smd: 1(-1.542,0) 2(1.542,0)
SOIC-8_L4.9-W3.9-P1.27-LS6.0-BL
  oval 0.588x2.045 smd: 1(-1.905,-2.772) 2(-0.635,-2.772) 3(0.635,-2.772) 4(1.905,-2.772) 5(1.905,2.772) 6(0.635,2.772) 7(-0.635,2.772) 8(-1.905,2.772)
Test-Point-0.5mm
  round 0.5 smd: 1(0,0)
TF-SMD_TF-01A
  rect 0.6x1.3 smd: 1(2.3,5.276) 2(1.2,5.276) 3(0.101,5.276) 4(-1,5.276) 5(-2.099,5.276) 6(-3.2,5.276) 7(-4.3,5.276) 8(-5.399,5.276) 9(-6.5,5.276)
  rect 1.2x1.4 smd: 10(-7.599,4.426) 13(7.08,4.426)
  rect 1.2x2 smd: 11(-7.76,-5.276) 12(7.76,-5.276)
TSSOP-20_L6.5-W4.4-P0.65-LS6.4-BL
  oval 0.364x1.742 smd: 1(-2.925,-2.871) 2(-2.275,-2.871) 3(-1.625,-2.871) 4(-0.975,-2.871) 5(-0.325,-2.871) 6(0.325,-2.871) 7(0.975,-2.871) 8(1.625,-2.871) 9(2.275,-2.871) 10(2.925,-2.871) 11(2.925,2.871) 12(2.275,2.871) 13(1.625,2.871) 14(0.975,2.871) 15(0.325,2.871) 16(-0.325,2.871) 17(-0.975,2.871) 18(-1.625,2.871) 19(-2.275,2.871) 20(-2.925,2.871)
WIFI-SMD_ESP32-WROOM-32E
  rect 0.95x2.1 smd: 1(-9.002,-9) 2(-7.732,-9) 3(-6.463,-9) 4(-5.192,-9) 5(-3.922,-9) 6(-2.652,-9) 7(-1.383,-9) 8(-0.113,-9) 9(1.157,-9) 10(2.428,-9) 11(3.697,-9) 12(4.968,-9) 13(6.237,-9) 14(7.508,-9) 25(7.508,9) 26(6.237,9) 27(4.968,9) 28(3.697,9) 29(2.428,9) 30(1.157,9) 31(-0.113,9) 32(-1.383,9) 33(-2.652,9) 34(-3.922,9) 35(-5.192,9) 36(-6.463,9) 37(-7.732,9) 38(-9.002,9)
  rect 2.1x0.95 smd: 15(9.002,-5.715) 16(9.002,-4.445) 17(9.002,-3.175) 18(9.002,-1.905) 19(9.002,-0.635) 20(9.002,0.635) 21(9.002,1.905) 22(9.002,3.175) 23(9.002,4.445) 24(9.002,5.715)
  rect 0.9x0.9 smd: 39(-2.721,-0.1) 39(-2.721,-1.5) 39(-2.721,-2.9) 39(-1.321,-0.1) 39(-1.321,-1.5) 39(-1.321,-2.9) 39(0.079,-0.1) 39(0.079,-1.5) 39(0.079,-2.9)

## Nets
+5V: U5.6
GND: NOREF#2.41 U5.2 U5.4 U5.7 扬声器-.1
3.3GND: R2.2 U1.39 U2.11 U2.16 U2.17
$1N2705: CARD1.7 U1.31
$1N2711: CARD1.2 U1.29
$1N2735: CARD1.3 U1.37
$1N2743: CARD1.5 U1.30
$1N3554: U1.10 U2.15
$1N3572: U1.11 U2.14
$1N3599: U1.12 U2.13
$1N3623: U1.25 U2.12
$1N4800: CARD1.12 U1.38
$1N5629: C1.2 C2.1 C5.2 CARD1.6 CARD1.9 U1.1 U2.3 U2.19
$1N5977: C3.2 C4.1 C6.1 U1.15 U2.9
$1N6377: C6.2 C7.2 U2.4
$1N7060: U2.6 U5.3
$1N7277: NOREF.40 U5.5 扬声器+.1
$1N7422: C1.1 C2.2 C3.1 C4.2 C5.1 C7.1 CARD1.4 R1.1 U1.2 U2.1 U2.2 U2.8 U2.10 U2.20 U6.10
$1N7801: R1.2 R2.1 U1.7
$1N8491: U6.2 USB1.2
$1N8514: U6.1 USB1.3
$1N8590: C8.1 U6.3 USB1.5
$1N8673: C8.2 U6.7 USB1.1
$1N8909: U1.34 U6.9
$1N8955: U1.35 U6.8

Pads without a net: CARD1 1 8 10 11 13; U1 3 4 5 6 8 9 13 14 16 17 18 19 20 21 22 23 24 26 27 28 32 33 36; U2 5 7 18; U5 1 8; U6 4 5 6; USB1 4 6 7 8 9
